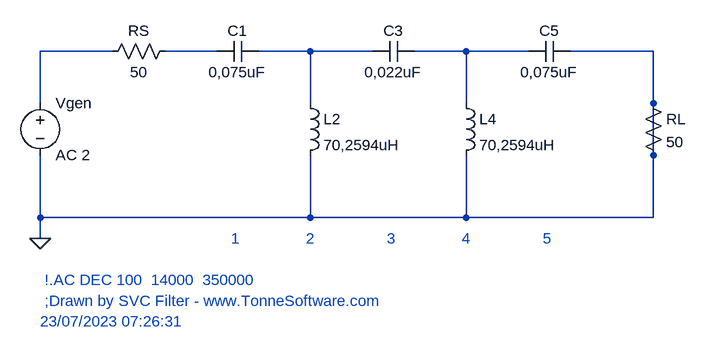
[diagram p0: schematic passe-haut-70kHz.asc]
passe-haut-70kHz.asc, the LTspice schematic file:
Version 4
SHEET 1  928  600
SYMBOL voltage  0  144 R0
WINDOW 123 24 132 Left 0
SYMATTR InstName Vgen
SYMATTR Value AC 2
SYMBOL res 208  64 R90
WINDOW 0 0 56 Vbottom 0
WINDOW 3 32 56 Vtop 0
SYMATTR InstName RS
SYMATTR Value 50 
WIRE  0  160  0  80 
WIRE  0  80  112  80 
WIRE  192  80  224  80 
WIRE  0  240  0  336 
WIRE  0  336  224  336 
WIRE  0  336  0  368 
FLAG  0  368 0
TEXT 0 432 Left 0  !.AC DEC 100  14000  350000 
TEXT 0 464 Left 0  ;Drawn by SVC Filter - www.TonneSoftware.com
TEXT 0 496 Left 0 23/07/2023 07:26:31 
SYMBOL cap  336  64 R90
WINDOW 0 0 32 Vbottom 0
WINDOW 3 32 32 Vtop 0
SYMATTR InstName C1
SYMATTR Value 0,075uF
WIRE  224  80  272  80 
WIRE  336  80  368  80 
WIRE  224  336  368  336 
TEXT  300 368 Center 0 ; 1 
SYMBOL ind  400  144 R0
SYMATTR InstName L2
SYMATTR Value 70,2594uH
SYMATTR SpiceLine Rser=3,09017E-05
WIRE  368  80  464  80 
WIRE  416  80  416  160 
WIRE  416  240  416  336 
WIRE  368  336  464  336 
TEXT  416 368 Center 0 ; 2 
SYMBOL cap  576  64 R90
WINDOW 0 0 32 Vbottom 0
WINDOW 3 32 32 Vtop 0
SYMATTR InstName C3
SYMATTR Value 0,022uF
WIRE  464  80  512  80 
WIRE  576  80  608  80 
WIRE  464  336  608  336 
TEXT  540 368 Center 0 ; 3 
SYMBOL ind  640  144 R0
SYMATTR InstName L4
SYMATTR Value 70,2594uH
SYMATTR SpiceLine Rser=3,09017E-05
WIRE  608  80  704  80 
WIRE  656  80  656  160 
WIRE  656  240  656  336 
WIRE  608  336  704  336 
TEXT  656 368 Center 0 ; 4 
SYMBOL cap  816  64 R90
WINDOW 0 0 32 Vbottom 0
WINDOW 3 32 32 Vtop 0
SYMATTR InstName C5
SYMATTR Value 0,075uF
WIRE  704  80  752  80 
WIRE  816  80  848  80 
WIRE  704  336  848  336 
TEXT  780 368 Center 0 ; 5 
SYMBOL res  928  144 R0
SYMATTR InstName RL
SYMATTR Value 50 
WIRE  848  80  944  80 
WIRE  944  80  944  160 
WIRE  848  336  944  336 
WIRE  944  336  944  160

The netlist it stands for:
* passe-haut-70kHz.asc
Vgen N001 0 AC 2
RS N002 N001 50
C1 N003 N002 0,075uF
L2 N003 0 70,2594uH Rser=3,09017E-05
C3 N004 N003 0,022uF
L4 N004 0 70,2594uH Rser=3,09017E-05
C5 0 N004 0,075uF
RL 0 0 50
*  !.AC DEC 100  14000  350000
*  ;Drawn by SVC Filter - www.TonneSoftware.com
* 23/07/2023 07:26:31
*  1
*  2
*  3
*  4
*  5
.backanno
.end